# Altium schematic sheet Arduino Headers.SchDoc: Shield Headers
size B; CompanyName: Cospan Design; DrawnBy: David McCoy; Engineer: David McCoy; Organization: Cospan Design; DocumentNumber: 2; Revision: .revision; SheetNumber: 2; SheetTotal: 4
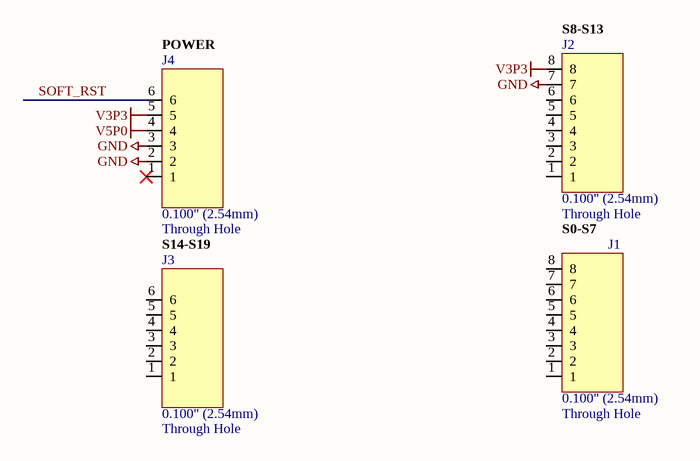
[diagram p0: Arduino Headers.SchDoc]

## Parts
J1  Pitch: 0.100" (2.54mm)  Mounting Type: Through Hole  [HDR_1X8]  (hidden comment: J_HDR1X8_THRHOLE_VERT)
J2  Pitch: 0.100" (2.54mm)  Mounting Type: Through Hole  [HDR_1X8]  (hidden comment: J_HDR1X8_THRHOLE_VERT)
J3  Pitch: 0.100" (2.54mm)  Mounting Type: Through Hole  [HDR_1X6]  (hidden comment: J_HDR1X6_THRHOLE_VERT)
J4  Pitch: 0.100" (2.54mm)  Mounting Type: Through Hole  [HDR_1X6]  (hidden comment: J_HDR1X6_THRHOLE_VERT)

## Nets
GND: J2.7 J4.2 J4.3
V3P3: J2.8 J4.5
V5P0: J4.4
SOFT_RST: J4.6

Not connected (* = marked no-connect by the designer): J1 1 2 3 4 5 6 7 8; J2 1 2 3 4 5 6; J3 1 2 3 4 5 6; J4 1*

## Notes on the sheet
- (near J2) S8-S13
- (near J4) POWER
- S14-S19
- S0-S7
- Title:
- http://www.cospandesign.com
- Cospan Design
- Project:
- Document:
- Engineer:
- Drawn By:
- Approved By:
- Revision:
- Date:
- Number:
- of

## Library data of the parts
J1 J2 = J_HDR1X8_THRHOLE_VERT: CONN HEADER .100" 12POS TIN PCB; Manufacturer: Samtec; Manufacturer Part Number: TS-108-T-A; Connector Type: Unshrouded; Number of Positions: 8; Number of Positions Loaded: All; Supplier 1: Samtec Inc; Supplier Part Number 1: TS-108-T-A; RoHS: RoHS Compliant; Category: Connectors, Interconnects; Stock 1: 764; Number of Rows: 1; Row Spacing: -; Height Stacking (Mating): -; Height Above Board: 0.100" (2.54mm); Contact Mating Length: 0.166" (4.22mm); Termination: Solder; Contact Finish: Tin; Contact Finish Thickness: 200µin (5.08µm); Features: -; Color: Black; Packaging: Bulk; ComponentLink1URL: http://www.samtec.com/ftppub/cpdf/TX-MKT1.PDF; ComponentLink1Description: http://www.samtec.com/ftppub/cpdf/TX-MKT1.PDF
J3 J4 = J_HDR1X6_THRHOLE_VERT: CONN HEADER .100" 12POS TIN PCB; Manufacturer: Samtec; Manufacturer Part Number: TSW-106-07-T-S; Connector Type: Unshrouded; Number of Positions: 6; Number of Positions Loaded: All; Supplier 1: Samtec; Supplier Part Number 1: TSW-106-07-T-S; RoHS: RoHS Compliant; Category: Connectors, Interconnects; Stock 1: 0; Number of Rows: 1; Row Spacing: -; Height Stacking (Mating): -; Height Above Board: 0.100" (2.54mm); Contact Mating Length: 0.166" (4.22mm); Termination: Solder; Contact Finish: Tin; Contact Finish Thickness: 200µin (5.08µm); Features: -; Color: Black; Packaging: Bulk; ComponentLink1URL: http://www.samtec.com/ftppub/cpdf/TX-MKT1.PDF; ComponentLink1Description: http://www.samtec.com/ftppub/cpdf/TX-MKT1.PDF; Molding Height Above Board: 0.100" (2.54mm); ComponentLink2URL: http://www.samtec.com/ftppub/pdf/TD.PDF; ComponentLink2Description: http://www.samtec.com/ftppub/pdf/TD.PDF